# EAGLE schematic SPARK Schematic (EAGLE 9.7.0)
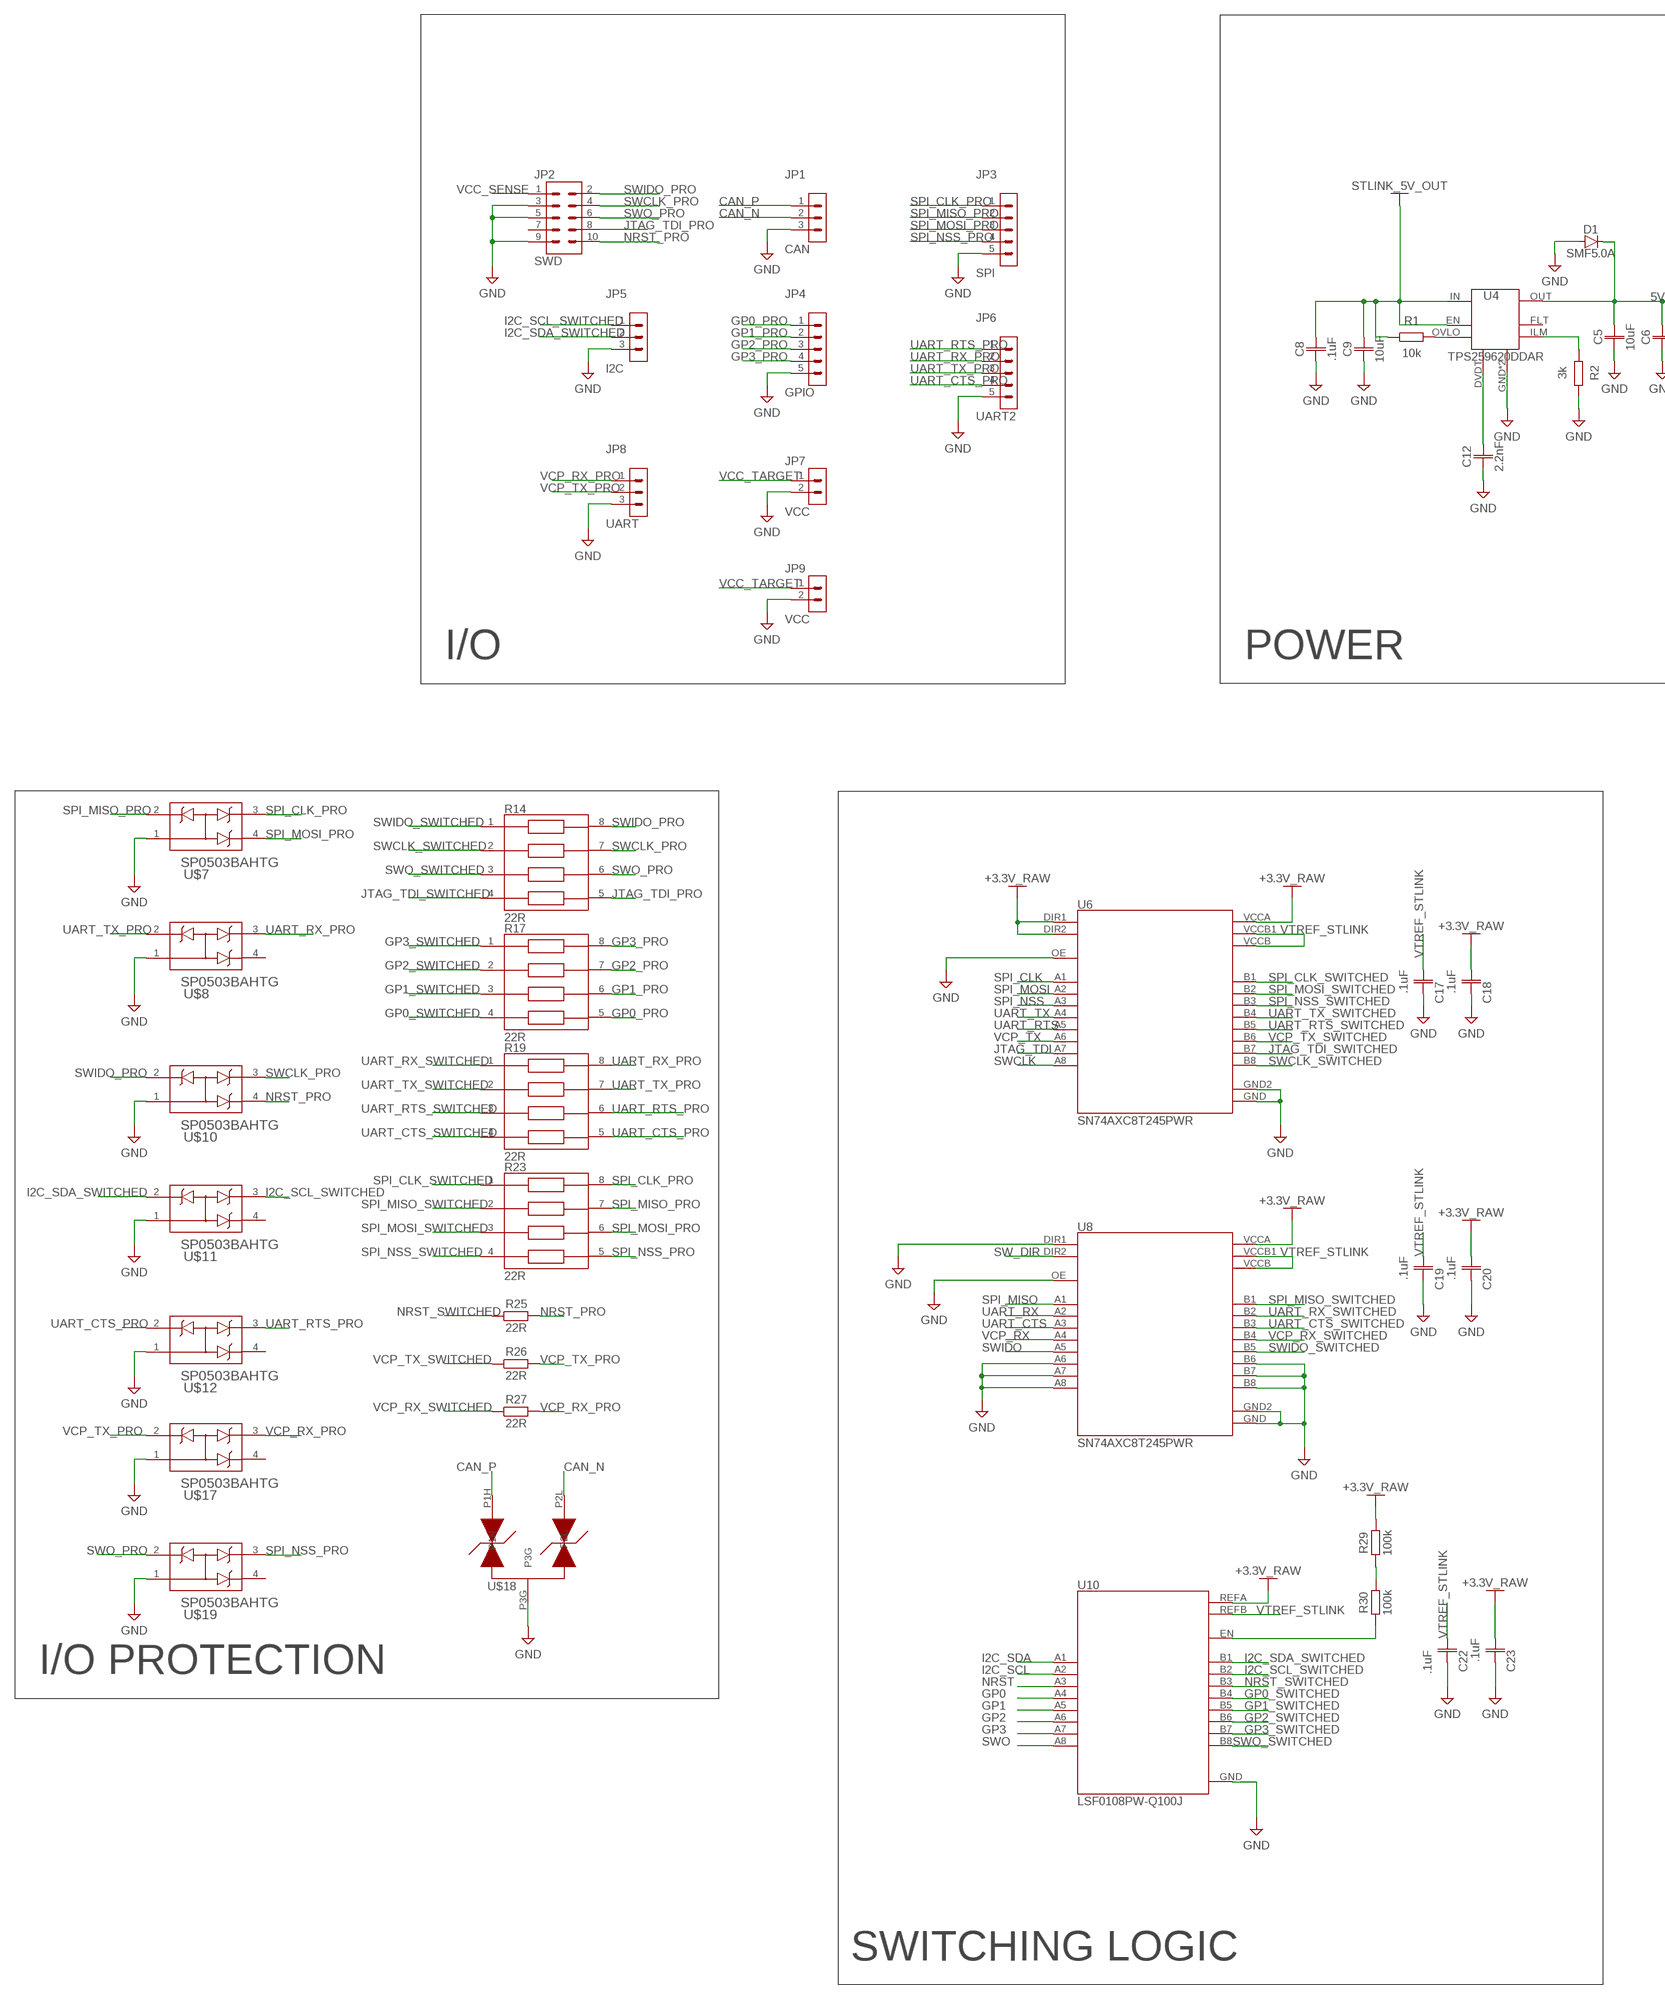
[diagram p0: schematic, sheet 1, part 1 of 2]
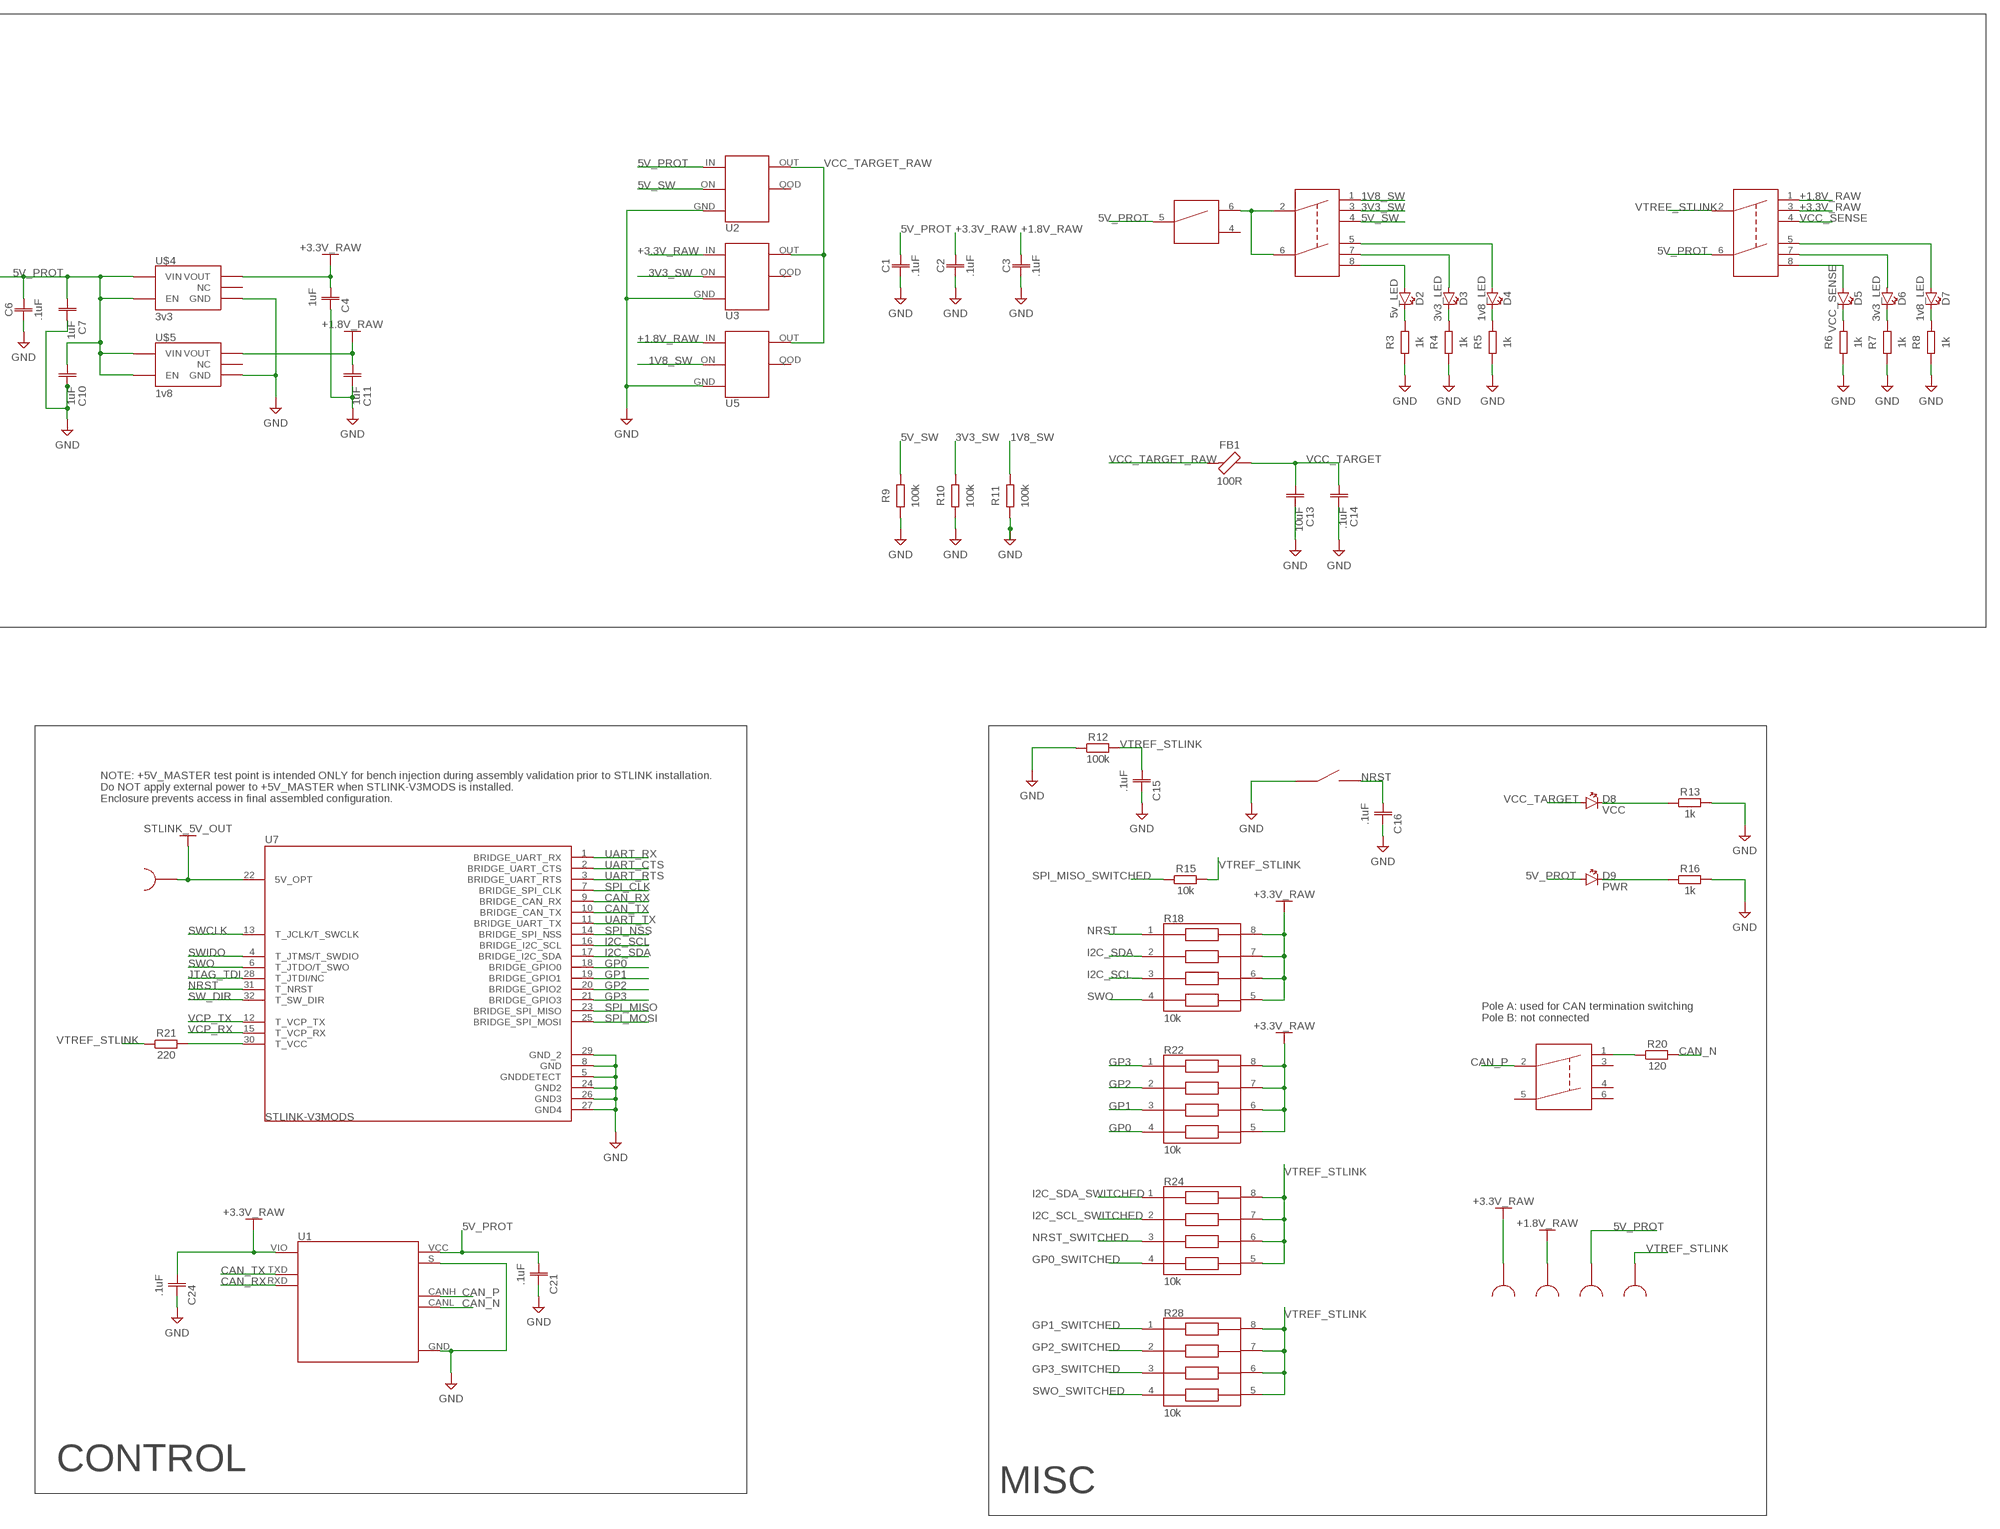
[diagram p1: schematic, sheet 1, part 2 of 2]

## Parts
C1  .1uF  C_CHIP-0805(2012-METRIC)  [CAPC2012X110]
C2  .1uF  C_CHIP-0805(2012-METRIC)  [CAPC2012X110]
C3  .1uF  C_CHIP-0805(2012-METRIC)  [CAPC2012X110]
C4  1uF  C_CHIP-0805(2012-METRIC)  [CAPC2012X110]
C5  10uF  C_CHIP-0805(2012-METRIC)  [CAPC2012X110]
C6  .1uF  C_CHIP-0805(2012-METRIC)  [CAPC2012X110]
C7  1uF  C_CHIP-0805(2012-METRIC)  [CAPC2012X110]
C8  .1uF  C_CHIP-0805(2012-METRIC)  [CAPC2012X110]
C9  10uF  C_CHIP-0805(2012-METRIC)  [CAPC2012X110]
C10  1uF  C_CHIP-0805(2012-METRIC)  [CAPC2012X110]
C11  1uF  C_CHIP-0805(2012-METRIC)  [CAPC2012X110]
C12  2.2nF  C_CHIP-0805(2012-METRIC)  [CAPC2012X110]
C13  10uF  C_CHIP-0805(2012-METRIC)  [CAPC2012X110]
C14  .1uF  C_CHIP-0805(2012-METRIC)  [CAPC2012X110]
C15  .1uF  C_CHIP-0805(2012-METRIC)  [CAPC2012X110]
C16  .1uF  C_CHIP-0805(2012-METRIC)  [CAPC2012X110]
C17  .1uF  C_CHIP-0805(2012-METRIC)  [CAPC2012X110]
C18  .1uF  C_CHIP-0805(2012-METRIC)  [CAPC2012X110]
C19  .1uF  C_CHIP-0805(2012-METRIC)  [CAPC2012X110]
C20  .1uF  C_CHIP-0805(2012-METRIC)  [CAPC2012X110]
C21  .1uF  C_CHIP-0805(2012-METRIC)  [CAPC2012X110]
C22  .1uF  C_CHIP-0805(2012-METRIC)  [CAPC2012X110]
C23  .1uF  C_CHIP-0805(2012-METRIC)  [CAPC2012X110]
C24  .1uF  C_CHIP-0805(2012-METRIC)  [CAPC2012X110]
D1  SMF5.0A  DIODE_1N4148W-7-F_SOD123G  [SOD3715X135]
D2  5v_LED  CHIP-FLAT-R_0805  [LEDC2012X110N_FLAT-R]
D3  3v3_LED  CHIP-FLAT-R_0805  [LEDC2012X110N_FLAT-R]
D4  1v8_LED  CHIP-FLAT-R_0805  [LEDC2012X110N_FLAT-R]
D5  VCC_SENSE  CHIP-FLAT-R_0805  [LEDC2012X110N_FLAT-R]
D6  3v3_LED  CHIP-FLAT-R_0805  [LEDC2012X110N_FLAT-R]
D7  1v8_LED  CHIP-FLAT-R_0805  [LEDC2012X110N_FLAT-R]
D8  VCC  CHIP-FLAT-G_0805  [LEDC2012X110N_FLAT-G]
D9  PWR  CHIP-FLAT-G_0805  [LEDC2012X110N_FLAT-G]
FB1  100R  FBCHIP-0805(2012-METRIC)  [BEADC2012X105N]
JP1  CAN  PINHD-1X3  [1X03]
JP2  SWD  PINHD-2X5  [2X05]
JP3  SPI  PINHD-1X5  [1X05]
JP4  GPIO  PINHD-1X5  [1X05]
JP5  I2C  PINHD-1X3  [1X03]
JP6  UART2  PINHD-1X5  [1X05]
JP7  VCC  PINHD-1X2  [1X02]
JP8  UART  PINHD-1X3  [1X03]
JP9  VCC  PINHD-1X2  [1X02]
R1  10k  R_CHIP-0805(2012-METRIC)  [RESC2012X65]
R2  3k  R_CHIP-0805(2012-METRIC)  [RESC2012X65]
R3  1k  R_CHIP-0805(2012-METRIC)  [RESC2012X65]
R4  1k  R_CHIP-0805(2012-METRIC)  [RESC2012X65]
R5  1k  R_CHIP-0805(2012-METRIC)  [RESC2012X65]
R6  1k  R_CHIP-0805(2012-METRIC)  [RESC2012X65]
R7  1k  R_CHIP-0805(2012-METRIC)  [RESC2012X65]
R8  1k  R_CHIP-0805(2012-METRIC)  [RESC2012X65]
R9  100k  R_CHIP-0805(2012-METRIC)  [RESC2012X65]
R10  100k  R_CHIP-0805(2012-METRIC)  [RESC2012X65]
R11  100k  R_CHIP-0805(2012-METRIC)  [RESC2012X65]
R12  100k  R_CHIP-0805(2012-METRIC)  [RESC2012X65]
R13  1k  R_CHIP-0805(2012-METRIC)  [RESC2012X65]
R14  22R  CAY16-220J4LFCAY16-220J4LF  [CAY16-220J4LF]
R15  10k  R_CHIP-0805(2012-METRIC)  [RESC2012X65]
R16  1k  R_CHIP-0805(2012-METRIC)  [RESC2012X65]
R17  22R  CAY16-220J4LFCAY16-220J4LF  [CAY16-220J4LF]
R18  10k  CAY16-220J4LFCAY16-220J4LF  [CAY16-220J4LF]
R19  22R  CAY16-220J4LFCAY16-220J4LF  [CAY16-220J4LF]
R20  120  R_CHIP-0805(2012-METRIC)  [RESC2012X65]
R21  220  R_CHIP-0805(2012-METRIC)  [RESC2012X65]
R22  10k  CAY16-220J4LFCAY16-220J4LF  [CAY16-220J4LF]
R23  22R  CAY16-220J4LFCAY16-220J4LF  [CAY16-220J4LF]
R24  10k  CAY16-220J4LFCAY16-220J4LF  [CAY16-220J4LF]
R25  22R  R_CHIP-0805(2012-METRIC)  [RESC2012X65]
R26  22R  R_CHIP-0805(2012-METRIC)  [RESC2012X65]
R27  22R  R_CHIP-0805(2012-METRIC)  [RESC2012X65]
R28  10k  CAY16-220J4LFCAY16-220J4LF  [CAY16-220J4LF]
R29  100k  R_CHIP-0805(2012-METRIC)  [RESC2012X65]
R30  100k  R_CHIP-0805(2012-METRIC)  [RESC2012X65]
S1  JS202011SCQN  [JS202011SCQN]
U1  TCAN1051HGVDRTCAN1051HGVDR  [TCAN1051HGVDR]
U2  5v  TPS22919DCKR  [TPS22919DCKR]
U3  3v3  TPS22919DCKR  [TPS22919DCKR]
U4  TPS259620DDAR  [TPS259620DDAR]
U5  1v8  TPS22919DCKR  [TPS22919DCKR]
U6  SN74AXC8T245PWR  SN74AXC8T245PWRSN74AXC8T245PWR  [SN74AXC8T245PWR]
U7  STLINK-V3MODS  [STLINK-V3MODS]
U8  SN74AXC8T245PWR  SN74AXC8T245PWRSN74AXC8T245PWR  [SN74AXC8T245PWR]
U10  LSF0108PW-Q100J  LSF0108PW-Q100JLSF0108PW-Q100J  [LSF0108PW-Q100J]
U$1  GW12RCPGW12RCP  [GW12RCP]
U$2  OS203012MU5QP1  [OS203012MU5QP1]
U$3  OS203012MU5QP1  [OS203012MU5QP1]
U$4  3v3  AP2112K  [AP2112K]
U$5  1v8  AP2112K  [AP2112K]
U$6  RESET  TACTILE_SWITCH  [TACTILE_SWITCH]
U$7  SP0503BAHTG  [SP0503BAHTG]
U$8  SP0503BAHTG  [SP0503BAHTG]
U$9  5011TESTPOINT  [5011TESTPOINT]
U$10  SP0503BAHTG  [SP0503BAHTG]
U$11  SP0503BAHTG  [SP0503BAHTG]
U$12  SP0503BAHTG  [SP0503BAHTG]
U$13  5011TESTPOINT  [5011TESTPOINT]
U$14  5011TESTPOINT  [5011TESTPOINT]
U$15  5011TESTPOINT  [5011TESTPOINT]
U$16  5011TESTPOINT  [5011TESTPOINT]
U$17  SP0503BAHTG  [SP0503BAHTG]
U$18  SM24CANB-02HTG  [SM24CANB-02HTG]
U$19  SP0503BAHTG  [SP0503BAHTG]

## Nets
1V8_SW: R11.2 U5.ON U$2.1
3V3_SW: R10.2 U3.ON U$2.3
5V_PROT: C1.2 C5.2 C6.2 C7.1 C10.1 C21.1 D1.1(C) D9.A U1.VCC U2.IN U4.OUT U$1.5 U$3.6 U$4.P$1(VIN) U$4.P$3(EN) U$5.P$1(VIN) U$5.P$3(EN) U$15.P$1
5V_SW: R9.2 U2.ON U$2.4
+1.8V_RAW: C3.2 C11.1 U5.IN U$3.1 U$5.P$5(VOUT) U$14.P$1
+3.3V_RAW: C2.2 C4.1 C18.1 C20.1 C23.1 C24.1 R18.5 R18.6 R18.7 R18.8 R22.5 R22.6 R22.7 R22.8 R29.2 U1.VIO U3.IN U6.DIR1 U6.DIR2 U6.VCCA U8.VCCA U10.REFA U$3.3 U$4.P$5(VOUT) U$13.P$1
CAN_N: JP1.2 R20.2 U1.CANL U$18.P2L
CAN_P: JP1.1 S1.2 U1.CANH U$18.P1H
CAN_RX: U1.RXD U7.9(BRIDGE_CAN_RX)
CAN_TX: U1.TXD U7.10(BRIDGE_CAN_TX)
GND: C1.1 C2.1 C3.1 C4.2 C5.1 C6.1 C7.2 C8.1 C9.1 C10.2 C11.2 C12.1 C13.2 C14.2 C15.2 C16.2 C17.2 C18.2 C19.2 C20.2 C21.2 C22.2 C23.2 C24.2 D1.2(A) JP1.3 JP2.3 JP2.5 JP2.9 JP3.5 JP4.5 JP5.3 JP6.5 JP7.2 JP8.3 JP9.2 R2.2 R3.1 R4.1 R5.1 R6.1 R7.1 R8.1 R9.1 R10.1 R11.1 R12.1 R13.2 R16.2 U1.GND U1.S U2.GND U3.GND U4.GND U4.GND1(GND) U5.GND U6.GND U6.GND2 U6.OE U7.5(GNDDETECT) U7.8(GND) U7.24(GND2) U7.26(GND3) U7.27(GND4) U7.29(GND_2) U8.A6 U8.A7 U8.A8 U8.B6 U8.B7 U8.B8 U8.DIR1 U8.GND U8.GND2 U8.OE U10.GND U$4.P$2(GND) U$5.P$2(GND) U$6.P$1 U$6.P$3 U$7.1 U$8.1 U$10.1 U$11.1 U$12.1 U$17.1 U$18.P3G U$19.1
GP0: R22.4 U7.18(BRIDGE_GPIO0) U10.A4
GP0_PRO: JP4.1 R17.5
GP0_SWITCHED: R17.4 R24.4 U10.B4
GP1: R22.3 U7.19(BRIDGE_GPIO1) U10.A5
GP1_PRO: JP4.2 R17.6
GP1_SWITCHED: R17.3 R28.1 U10.B5
GP2: R22.2 U7.20(BRIDGE_GPIO2) U10.A6
GP2_PRO: JP4.3 R17.7
GP2_SWITCHED: R17.2 R28.2 U10.B6
GP3: R22.1 U7.21(BRIDGE_GPIO3) U10.A7
GP3_PRO: JP4.4 R17.8
GP3_SWITCHED: R17.1 R28.3 U10.B7
I2C_SCL: R18.3 U7.16(BRIDGE_I2C_SCL) U10.A2
I2C_SCL_SWITCHED: JP5.1 R24.2 U10.B2 U$11.3
I2C_SDA: R18.2 U7.17(BRIDGE_I2C_SDA) U10.A1
I2C_SDA_SWITCHED: JP5.2 R24.1 U10.B1 U$11.2
JTAG_TDI: U6.A7 U7.28(T_JTDI/NC)
JTAG_TDI_PRO: JP2.8 R14.5
JTAG_TDI_SWITCHED: R14.4 U6.B7
N$1: R1.2 U4.OVLO
N$2: D7.C R8.2
N$3: D6.C R7.2
N$4: D8.C R13.1
N$6: R2.1 U4.ILM
N$7: C12.2 U4.DVDT
N$8: D5.C R6.2
N$9: D5.A U$3.8
N$11: D6.A U$3.7
N$12: D7.A U$3.5
N$13: R30.1 U10.EN
N$14: D9.C R16.1
N$15: U$1.6 U$2.2 U$2.6
N$16: D4.C R5.2
N$17: D3.C R4.2
N$18: D2.C R3.2
N$19: D2.A U$2.8
N$20: D3.A U$2.7
N$21: D4.A U$2.5
N$23: R20.1 S1.1
N$24: R21.2 U7.30(T_VCC)
N$72: R29.1 R30.2
NRST: C16.1 R18.1 U7.31(T_NRST) U10.A3 U$6.P$2 U$6.P$4
NRST_PRO: JP2.10 R25.2 U$10.4
NRST_SWITCHED: R24.3 R25.1 U10.B3
SPI_CLK: U6.A1 U7.7(BRIDGE_SPI_CLK)
SPI_CLK_PRO: JP3.1 R23.8 U$7.3
SPI_CLK_SWITCHED: R23.1 U6.B1
SPI_MISO: U7.23(BRIDGE_SPI_MISO) U8.A1
SPI_MISO_PRO: JP3.2 R23.7 U$7.2
SPI_MISO_SWITCHED: R15.1 R23.2 U8.B1
SPI_MOSI: U6.A2 U7.25(BRIDGE_SPI_MOSI)
SPI_MOSI_PRO: JP3.3 R23.6 U$7.4
SPI_MOSI_SWITCHED: R23.3 U6.B2
SPI_NSS: U6.A3 U7.14(BRIDGE_SPI_NSS)
SPI_NSS_PRO: JP3.4 R23.5 U$19.3
SPI_NSS_SWITCHED: R23.4 U6.B3
STLINK_5V_OUT: C8.2 C9.2 R1.1 U4.EN U4.IN U7.22(5V_OPT) U$9.P$1
SW_DIR: U7.32(T_SW_DIR) U8.DIR2
SWCLK: U6.A8 U7.13(T_JCLK/T_SWCLK)
SWCLK_PRO: JP2.4 R14.7 U$10.3
SWCLK_SWITCHED: R14.2 U6.B8
SWIDO: U7.4(T_JTMS/T_SWDIO) U8.A5
SWIDO_PRO: JP2.2 R14.8 U$10.2
SWIDO_SWITCHED: R14.1 U8.B5
SWO: R18.4 U7.6(T_JTDO/T_SWO) U10.A8
SWO_PRO: JP2.6 R14.6 U$19.2
SWO_SWITCHED: R14.3 R28.4 U10.B8
UART_CTS: U7.2(BRIDGE_UART_CTS) U8.A3
UART_CTS_PRO: JP6.4 R19.5 U$12.2
UART_CTS_SWITCHED: R19.4 U8.B3
UART_RTS: U6.A5 U7.3(BRIDGE_UART_RTS)
UART_RTS_PRO: JP6.1 R19.6 U$12.3
UART_RTS_SWITCHED: R19.3 U6.B5
UART_RX: U7.1(BRIDGE_UART_RX) U8.A2
UART_RX_PRO: JP6.2 R19.8 U$8.3
UART_RX_SWITCHED: R19.1 U8.B2
UART_TX: U6.A4 U7.11(BRIDGE_UART_TX)
UART_TX_PRO: JP6.3 R19.7 U$8.2
UART_TX_SWITCHED: R19.2 U6.B4
VCC_SENSE: JP2.1 U$3.4
VCC_TARGET: C13.1 C14.1 D8.A FB1.2 JP7.1 JP9.1
VCC_TARGET_RAW: FB1.1 U2.OUT U3.OUT U5.OUT
VCP_RX: U7.15(T_VCP_RX) U8.A4
VCP_RX_PRO: JP8.1 R27.2 U$17.3
VCP_RX_SWITCHED: R27.1 U8.B4
VCP_TX: U6.A6 U7.12(T_VCP_TX)
VCP_TX_PRO: JP8.2 R26.2 U$17.2
VCP_TX_SWITCHED: R26.1 U6.B6
VTREF_STLINK: C15.1 C17.1 C19.1 C22.1 R12.2 R15.2 R21.1 R24.5 R24.6 R24.7 R24.8 R28.5 R28.6 R28.7 R28.8 U6.VCCB U6.VCCB1(VCCB2) U8.VCCB U8.VCCB1(VCCB2) U10.REFB U$3.2 U$16.P$1
Unconnected: JP2.7 S1.3 S1.4 S1.5 S1.6 U2.QOD U3.QOD U4.FLT U5.QOD U$1.4 U$4.P$4(NC) U$5.P$4(NC) U$8.4 U$11.4 U$12.4 U$17.4 U$19.4

## Notes on the sheet
- I/O | POWER
- NOTE: +5V_MASTER test point is intended ONLY for bench injection during assembly validation prior to STLINK installation.
  Do NOT apply external power to +5V_MASTER when STLINK-V3MODS is installed.
  Enclosure prevents access in final assembled configuration.
- Pole A: used for CAN termination switching
  Pole B: not connected
- CONTROL
- MISC
- I/O PROTECTION
- SWITCHING LOGIC

## Library data of the parts
C1-C24 = Capacitor:C: Capacitor - Generic
D1 = Diode:DIODE_: Diode Rectifier - Popular Parts
D2-D7 = LED:CHIP-FLAT-R: Red LED - Generic
D8 D9 = LED:CHIP-FLAT-G: Green LED - Generic
FB1 = Filter:FB: Ferrite Bead - Generic
JP1 JP5 JP8 = Connector:PINHD-1X3: Pin Header
JP2 = Connector:PINHD-2X5: Pin Header
JP3 JP4 JP6 = Connector:PINHD-1X5: Pin Header
JP7 JP9 = Connector:PINHD-1X2: Pin Header
R1-R13 R15 R16 R20 R21 R25-R27 R29 R30 = Resistor:R: Resistor Fixed - Generic
R14 R17-R19 R22-R24 R28 = Resistors:CAY16-220J4LF
S1 = Switches:JS202011SCQN
U1 = IC Devices:TCAN1051HGVDR
U2 U3 U5 = PowerComponents:TPS22919DCKR: https://www.digikey.com/en/products/detail/texas-instruments/TPS22919DCKR/10434801
U4 = PowerComponents:TPS259620DDAR: https://www.digikey.com/en/products/detail/texas-instruments/TPS259620DDAR/10445380
U6 U8 = IC Devices:SN74AXC8T245PWR
U7 = CohenLibrary:STLINK-V3MODS: https://www.digikey.com/en/products/detail/stmicroelectronics/STLINK-V3MODS/11610874
U10 = IC Devices:LSF0108PW-Q100J
U$1 = Switches:GW12RCP: https://www.digikey.com/en/products/detail/nkk-switches/GW12RCP/1052064
U$2 U$3 = Switches:OS203012MU5QP1: https://www.digikey.com/en/products/detail/c-k/OS203012MU5QP1/1981425
U$4 U$5 = CohenLibrary:AP2112K: https://www.digikey.com/en/products/detail/diodes-incorporated/AP2112K-3-3TRG1/4470746
U$6 = CohenLibrary:TACTILE_SWITCH: https://www.digikey.com/en/products/detail/c-k/PTS815SJM250SMTRLFS/9947846
U$7 U$8 U$10-U$12 U$17 U$19 = PowerComponents:SP0503BAHTG: https://www.digikey.com/en/products/detail/littelfuse-inc/SP0503BAHTG/1154308
U$9 U$13-U$16 = CohenLibrary:5011TESTPOINT: https://www.digikey.com/en/products/detail/keystone-electronics/5011/255333
U$18 = CohenLibrary:SM24CANB-02HTG: https://www.digikey.com/en/products/detail/littelfuse-inc/SM24CANB-02HTG/5048174?s=N4IgTCBcDaIMoFkwBYDCBBAcgIQLQAYwALAFwHMQBdAXyA